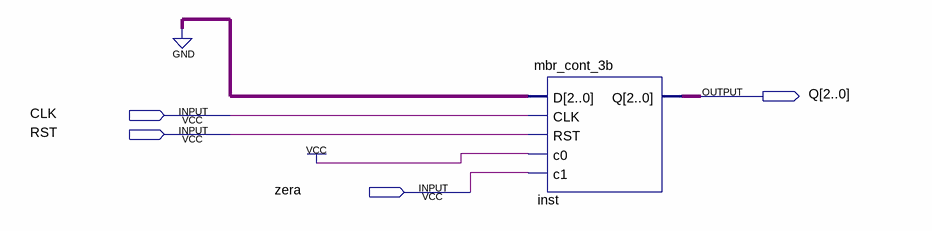
[diagram p0: schematic sheet]
// Quartus schematic mbr_temporizador.bdf as structural Verilog: 1 symbols, 4 pins
module mbr_temporizador (
  input  CLK,
  input  RST,
  input  zera,
  output [2:0] Q
);

  mbr_cont_3b inst (.D(3'b000), .CLK(CLK), .RST(RST), .c0(1'b1), .c1(zera), .Q(Q));
endmodule
